# Altium schematic sheet TDC_CH.SchDoc: FMC 5GS/s ADC/TDC
size 420 x 297 mm; Author: Agnieszka Bartkowicz; CompanyName: WUT ISE; DrawnBy: Agnieszka Bartkowicz; Engineer: Agnieszka Bartkowicz; Organization: WUT ISE; Address1: PW ISE; Address2: Nowowiejska 15/19 00-665 Warsaw; Address3: gyorka@o2.pl; SheetNumber: 7; SheetTotal: 13; ModifiedBy: -; CheckedDate: -; Title2: Title 2; DivGrp: WUT ISE; Designer: A. Bartkowicz
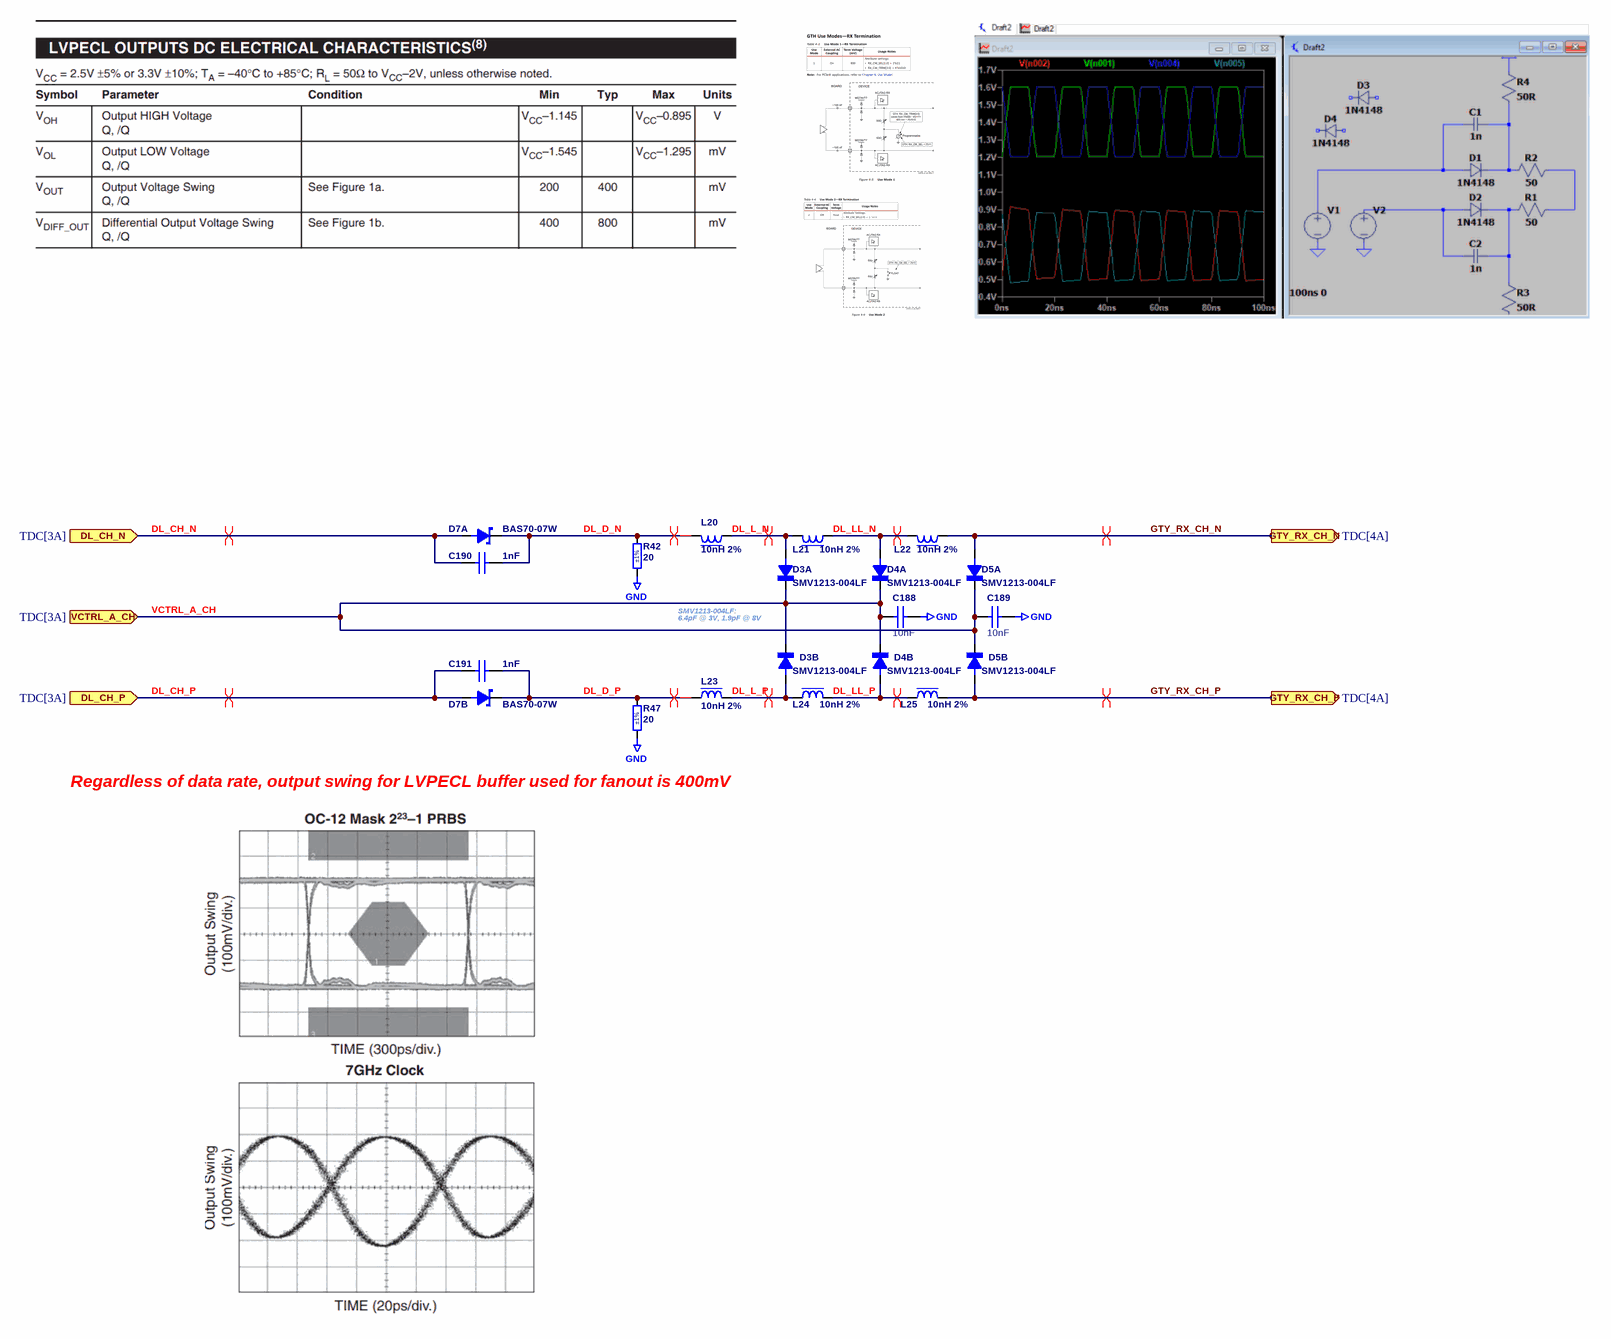
[diagram p0: TDC_CH.SchDoc]

## Parts
C188  10nF  [CAPC1005X55N]
C189  10nF  [CAPC1005X55N]
C190  1nF  [CAPC1005X55N]
C191  1nF  [CAPC1005X55N]
D3  SMV1213-004LF  [SOT23]  (parts A,B of 2)
D4  SMV1213-004LF  [SOT23]  (parts A,B of 2)
D5  SMV1213-004LF  [SOT23]  (parts A,B of 2)
D7  BAS70-07W  [SOT135P210X100-4N]  (parts A,B of 2)
L20  10nH 2%  [R0402]
L21  10nH 2%  [R0402]
L22  10nH 2%  [R0402]
L23  10nH 2%  [R0402]
L24  10nH 2%  [R0402]
L25  10nH 2%  [R0402]
R42  20  Tolerance: ±1%  [RESC1005X40N]
R47  20  Tolerance: ±1%  [RESC1005X40N]

## Ports
DL_CH_N (in, see TDC[3A]), DL_CH_P (in, see TDC[3A]), GTY_RX_CH_N (out, see TDC[4A]), GTY_RX_CH_P (out, see TDC[4A]), VCTRL_A_CH (in, see TDC[3A])

## Nets
GND: C188.1 C189.1 R42.1 R47.1
DL_CH_N: C190.1 D7.4(A) ; port DL_CH_N
DL_CH_P: C191.1 D7.3(A) ; port DL_CH_P
DL_D_N: C190.2 D7.1(K) L20.1 R42.2
DL_D_P: C191.2 D7.2(K) L23.1 R47.2
DL_L_N: D3.1(A) L20.2 L21.1
DL_L_P: D3.2(A) L23.2 L24.1
DL_LL_N: D4.1(A) L21.2 L22.1
DL_LL_P: D4.2(A) L24.2 L25.1
GTY_RX_CH_N: D5.1(A) L22.2 ; port GTY_RX_CH_N
GTY_RX_CH_P: D5.2(A) L25.2 ; port GTY_RX_CH_P
VCTRL_A_CH: C188.2 C189.2 D3.3(K) D4.3(K) D5.3(K) ; port VCTRL_A_CH

## Layout directives
differential pair: DL_CH_N, DL_CH_P, DL_D_N, DL_D_P, DL_L_N, DL_L_P, DL_LL_N, DL_LL_P, GTY_RX_CH_N, GTY_RX_CH_P

## Notes on the sheet
- (near D3) 6.4pF @ 3V, 1.9pF @ 8V
- SMV1213-004LF:
- (near R47) Regardless of data rate, output swing for LVPECL buffer used for fanout is 400mV
- Project/Equipment
- Document
- Designer
- Drawn by
- Check.by
- Copyright WUT ISE 2024.
  This documentation describes Open Hardware and is licensed under the CERN OHL v.2. You may redistribute and modify this documentation under the terms of the CERN OHL v.2. (http://ohwr.org/CERNOHL). This documentation is distributed WITHOUT ANY EXPRESS OR IMPLIED WARRANTY, INCLUDING OF MERCHANTABILITY, SATISFACTORY QUALITY AND FITNESS FOR A PARTICULAR PURPOSE. Please see the CERN OHL v.2 for applicable conditions.
- Contact
- File
- Last Mod.
- Print Date
- Sheet
- Size
- A3
- of
- Rev

## Library data of the parts
C188 C189 = CC0402_10NF_50V_10%_X7R: Non-polarised capacitor; Part Description: SMD Multilayer Chip Ceramic Capacitor; Manufacturer: GENERIC; Manufacturer1 Part Number: GRM155R71H103KA88D; Voltage: 50V; TC: X7R; Tolerance: ±10%; Part Number: CC0402_10NF_50V_10%_X7R; Component Kind: Standard; Component Type: Standard; Pin Count: 2; Value: 10nF; Status: None; Manufacturer Part Number: CC0402_10NF_50V_10%_X7R; Case: 0402; Mounted: Yes; Socket: No; SMD: Yes; Sense: No; Manufacturer1 Example: MURATA; Manufacturer1 ComponentHeight: 0.55mm; HelpURL: \\cern.ch\dfs\Applications\Altium\Datasheets\CC0402_X7R_MURATA_GRM.pdf; Author: CERN DEM MR; CreateDate: 08.01.2016; LatestRevisionDate: 08.01.2016
C190 C191 = CC0402_1NF_50V_10%_X7R: Non-polarised capacitor; Part Description: SMD Multilayer Chip Ceramic Capacitor; Manufacturer: GENERIC; Manufacturer1 Part Number: 223858715623; Voltage: 50V; TC: X7R; Tolerance: ±10%; Part Number: CC0402_1NF_50V_10%_X7R; Component Kind: Standard; Component Type: Standard; Pin Count: 2; Value: 1nF; Status: Not Recommended; Manufacturer Part Number: CC0402_1NF_50V_10%_X7R; Case: 0402; Mounted: Yes; Socket: No; SMD: Yes; Sense: No; Manufacturer1 Example: PHYCOMP; Manufacturer1 ComponentHeight: 0.55mm; HelpURL: \\cern.ch\dfs\Applications\Altium\Datasheets\CC0402_X7R_PHYCOMP.pdf; Author: CERN DEM JLC; CreateDate: 03.12.2007; LatestRevisionDate: 03.12.2007
D3-D5 = DIODE_SMV1213: Hyperabrupt Junction Tuning Varactors , double, common cathode
D7 = DIODE_BAS70-07W: General-purpose diode for high-speed switching
L20-L25 = IND_LQW15AN10NG00D: Murata Wirewound inductor 0402 package, 170mOhms, 500mA Q>25, self resonant freq. 5.5GHz, -55 +125C range
R42 R47 = R0402_20R_1%_0.0625W_100PPM: Resistor - 1%; Part Description: General Purpose Thick Film Chip Resistor; Manufacturer: GENERIC; Manufacturer1 Part Number: 232270672009L; TC: ±100ppm/°C; PressFit: No; Part Number: R0402_20R_1%_0.0625W_100PPM; Component Kind: Standard; Component Type: Standard; Pin Count: 2; Value: 20; Status: Not Recommended; Power: 0.0625W; Manufacturer Part Number: R0402_20R_1%_0.0625W_100PPM; Case: 0402; Mounted: Yes; Sense: No; Socket: No; SMD: Yes; Manufacturer1 Example: YAGEO PHYCOMP; Manufacturer1 ComponentHeight: 0.4mm; HelpURL: \\cern.ch\dfs\Applications\Altium\Datasheets\R0402_Phycomp_RC0402.pdf; Author: CERN DEM JLC; CreateDate: 03.12.2007; LatestRevisionDate: 17.10.2012